# Altium schematic sheet snes_hook.SchDoc: SNES Extension Header to IDC Header
size A; DrawnBy: Evan Custodio; Engineer: Evan Custodio; Revision: A
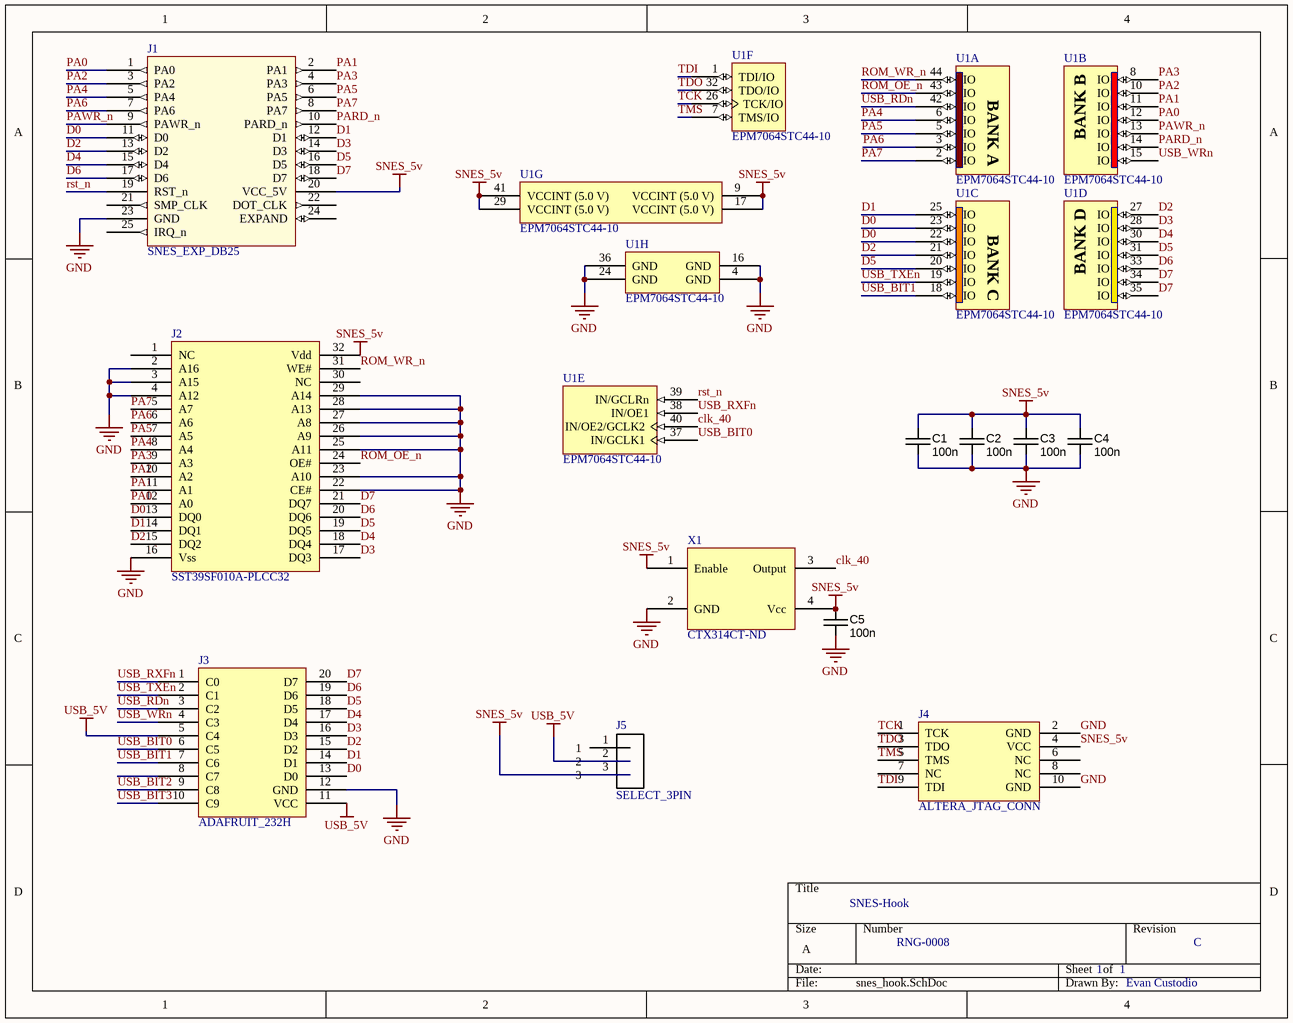
[diagram p0: snes_hook.SchDoc]

## Parts
C1  value 100n  [CAPC1608X90N]  (hidden comment: approved sub OK)
C2  value 100n  [CAPC1608X90N]  (hidden comment: approved sub OK)
C3  value 100n  [CAPC1608X90N]  (hidden comment: approved sub OK)
C4  value 100n  [CAPC1608X90N]  (hidden comment: approved sub OK)
C5  value 100n  [CAPC1608X90N]  (hidden comment: approved sub OK)
J1  SNES_EXP_DB25  [DB-25_RA_MPLUG]
J2  SST39SF010A-PLCC32  [PLCC_SOCKET_7x9_32P]
J3  ADAFRUIT_232H  [ADAFRUIT_232H]
J4  ALTERA_JTAG_CONN  [JTAG_CONN]
J5  SELECT_3PIN  [HEADER_3PIN]
U1  EPM7064STC44-10  [TQFP44_L]  (parts A,B,C,D,E,F,G,H of 8)
X1  CTX314CT-ND  [OSCILLATOR_7x5]

## Nets
GND: C1.2 C2.2 C3.2 C4.2 C5.2 J1.23(GND) J2.2(A16) J2.3(A15) J2.4(A12) J2.16(Vss) J2.22(CE#) J2.23(A10) J2.25(A11) J2.26(A9) J2.27(A8) J2.28(A13) J2.29(A14) J3.12(GND) J4.2(GND) J4.10(GND) U1.4(GND) U1.16(GND) U1.24(GND) U1.36(GND) X1.2(GND)
SNES_5v: C1.1 C2.1 C3.1 C4.1 C5.1 J1.20(VCC_5V) J2.32(Vdd) J4.4(VCC) J5.3 U1.9(VCCINT_(5.0_V)) U1.17(VCCINT_(5.0_V)) U1.29(VCCINT_(5.0_V)) U1.41(VCCINT_(5.0_V)) X1.1(Enable) X1.4(Vcc)
USB_5V: J3.5(C4) J3.11(VCC) J5.2
clk_40: U1.40(IN/OE2/GCLK2) X1.3(Output)
D0: J1.11(D0) J2.13(DQ0) J3.13(D0) U1.22(IO) U1.23(IO)
D1: J1.12(D1) J2.14(DQ1) J3.14(D1) U1.25(IO)
D2: J1.13(D2) J2.15(DQ2) J3.15(D2) U1.21(IO) U1.27(IO)
D3: J1.14(D3) J2.17(DQ3) J3.16(D3) U1.28(IO)
D4: J1.15(D4) J2.18(DQ4) J3.17(D4) U1.30(IO)
D5: J1.16(D5) J2.19(DQ5) J3.18(D5) U1.20(IO) U1.31(IO)
D6: J1.17(D6) J2.20(DQ6) J3.19(D6) U1.33(IO)
D7: J1.18(D7) J2.21(DQ7) J3.20(D7) U1.34(IO) U1.35(IO)
PA0: J1.1(PA0) J2.12(A0) U1.12(IO)
PA1: J1.2(PA1) J2.11(A1) U1.11(IO)
PA2: J1.3(PA2) J2.10(A2) U1.10(IO)
PA3: J1.4(PA3) J2.9(A3) U1.8(IO)
PA4: J1.5(PA4) J2.8(A4) U1.6(IO)
PA5: J1.6(PA5) J2.7(A5) U1.5(IO)
PA6: J1.7(PA6) J2.6(A6) U1.3(IO)
PA7: J1.8(PA7) J2.5(A7) U1.2(IO)
PARD_n: J1.10(PARD_n) U1.14(IO)
PAWR_n: J1.9(PAWR_n) U1.13(IO)
ROM_OE_n: J2.24(OE#) U1.43(IO)
ROM_WR_n: J2.31(WE#) U1.44(IO)
rst_n: J1.19(RST_n) U1.39(IN/GCLRn)
TCK: J4.1(TCK) U1.26(TCK/IO)
TDI: J4.9(TDI) U1.1(TDI/IO)
TDO: J4.3(TDO) U1.32(TDO/IO)
TMS: J4.5(TMS) U1.7(TMS/IO)
USB_BIT0: J3.6(C5) U1.37(IN/GCLK1)
USB_BIT1: J3.7(C6) U1.18(IO)
USB_BIT2: J3.9(C8)
USB_BIT3: J3.10(C9)
USB_RDn: J3.3(C2) U1.42(IO)
USB_RXFn: J3.1(C0) U1.38(IN/OE1)
USB_TXEn: J3.2(C1) U1.19(IO)
USB_WRn: J3.4(C3) U1.15(IO)

Not connected (* = marked no-connect by the designer): J1 21(SMP_CLK) 22(DOT_CLK) 24(EXPAND) 25(IRQ_n); J2 1(NC) 30(NC); J3 8(C7); J4 6(NC) 7(NC) 8(NC); J5 1

## Notes on the sheet
- SNES-Hook
- RNG-0008
- 1
- C
- (in symbol EPM7064STC44-10, part A) BANK A
- (in symbol EPM7064STC44-10, part B) BANK B
- (in symbol EPM7064STC44-10, part C) BANK C
- (in symbol EPM7064STC44-10, part D) BANK D

## Library data of the parts
C1-C5 = CAPC_100n_0603_X7R_50V_10%: Capacitor SMD Cer 100nF 10% 50V X7R 0603; Manufacturer 1: AVX Corporation; Manufacturer Part Number 1: 06035C104KAT2A; Ratings: 50V; X7R; Material: ceramic; SCDType: spec; Manufacturer 2: TDK Corporation; Manufacturer Part Number 2: C1608X7R1H104K; Package / Case: 0603 (1608 Metric); Tolerance: ±10%; Supplier 1: Digi-Key; Supplier Part Number 1: 478-5052-1-ND; ComponentLink1URL: http://www.avx.com/docs/Catalogs/cx7r.pdf; ComponentLink1Description: http://www.avx.com/docs/Catalogs/cx7r.pdf; Supplier 2: Digi-Key; Supplier Part Number 2: 445-1314-1-ND; ComponentLink2URL: http://product.tdk.com/capacitor/mlcc/en/documents/mlcc_commercial_general_en.pdf; ComponentLink2Description: http://product.tdk.com/capacitor/mlcc/en/documents/mlcc_commercial_general_en.pdf
U1 = EPM7064STC44-10: MAX 7000S 5V In-System Programmable CPLD, 64 Macrocells, 44-Pin TQFP, Speed Grade 10, Commercial Grade; Published: 24-Nov-2000; LatestRevisionDate: 13-Apr-2006; LatestRevisionNote: IPC-7351 Footprint Added.; DatasheetVersion: ver6.7, Sep-2005; PackageVersion: ver14.3, Jul-2006; PackageReference: TQFP44; Publisher: Altium Limited; PackageDescription: 44-Pin Plastic Thin Quad Flat Pack (TFQP44); Supplier 1: Digi-Key; Supplier Part Number 1: 544-1200-ND; Code_JEDEC: MS-026-ACB; ComponentLink1Description: Manufacturer Link; ComponentLink1URL: http://www.altera.com/products/devices/max7k/m7k-index.html; ComponentLink2Description: Datasheet; ComponentLink2URL: http://www.altera.com/literature/ds/m7000.pdf; ComponentLink3Description: Packaging Specification; ComponentLink3URL: http://www.altera.com/literature/ds/dspkg.pdf
X1 = CTX314CT-ND_40MHz: 40 MHz 5v Oscillator; Manufacturer: CTS-Frequency Controls; Manufacturer Part Number: CB3-3I-40M0000; Frequency: 40MHz; Function: Tri-State (Output Enable); Output: HCMOS, TTL; Frequency Stability: ±50ppm; Current - Supply (Max): 50mA; Current - Supply (Disable) (Max): 10µA; Supplier 1: Digi-Key; RoHS: RoHS Compliant; Category: Crystals and Oscillators; Stock 1: 1257; Pricing 1: 1=1.45, 10=1.392, 50=1.3614, 100=1.1642, 500=1.13344 (USD); Packaging: Cut Tape (CT); Type: XO (Standard); Voltage - Supply: 5V; Operating Temperature: -40°C ~ 85°C; Ratings: -; Mounting Type: Surface Mount; Size / Dimension: 0.276" L x 0.197" W (7.00mm x 5.00mm); Height: 0.067" (1.70mm); Package / Case: 4-SMD, No Lead (DFN, LCC); ComponentLink1URL: http://www.ctscorp.com/components/Datasheets/008-0256-0.pdf; ComponentLink1Description: http://www.ctscorp.com/components/Datasheets/008-0256-0.pdf; Supplier Part Number 1: CTX314CT-ND